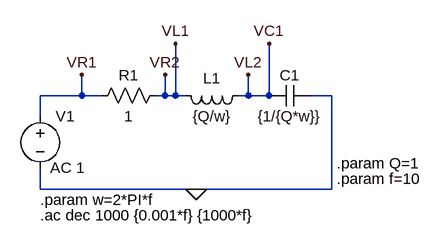
[diagram p0: schematic Circuito RLC serie.asc]
Circuito RLC serie.asc, the LTspice schematic file:
Version 4
SHEET 1 880 680
WIRE 96 96 96 64
WIRE 96 96 32 96
WIRE 128 96 96 96
WIRE 224 96 224 64
WIRE 224 96 208 96
WIRE 240 96 240 16
WIRE 240 96 224 96
WIRE 256 96 240 96
WIRE 352 96 352 64
WIRE 352 96 336 96
WIRE 384 96 384 16
WIRE 384 96 352 96
WIRE 480 96 448 96
WIRE 32 128 32 96
WIRE 32 240 32 208
WIRE 272 240 32 240
WIRE 480 240 480 96
WIRE 480 240 272 240
FLAG 272 240 0
FLAG 96 64 VR1
FLAG 240 16 VL1
FLAG 384 16 VC1
FLAG 224 64 VR2
FLAG 352 64 VL2
SYMBOL voltage 32 112 R0
WINDOW 3 9 102 Left 2
WINDOW 123 15 95 Left 2
WINDOW 39 0 0 Left 0
SYMATTR Value ""
SYMATTR Value2 AC 1
SYMATTR InstName V1
SYMBOL res 224 80 R90
WINDOW 0 0 56 VBottom 2
WINDOW 3 32 56 VTop 2
SYMATTR InstName R1
SYMATTR Value 1
SYMBOL ind 352 80 R90
WINDOW 0 5 56 VBottom 2
WINDOW 3 32 56 VTop 2
SYMATTR InstName L1
SYMATTR Value {Q/w}
SYMBOL cap 448 80 R90
WINDOW 0 0 32 VBottom 2
WINDOW 3 32 32 VTop 2
SYMATTR InstName C1
SYMATTR Value {1/{Q*w}}
TEXT 32 256 Left 2 !.param w=2*PI*f
TEXT 488 200 Left 2 !.param Q=1
TEXT 32 280 Left 2 !.ac dec 1000 {0.001*f} {1000*f}
TEXT 488 224 Left 2 !.param f=10

The netlist it stands for:
* Circuito RLC serie.asc
V1 VR1 0 AC 1
R1 VR2 VR1 1
L1 VL2 VR2 {Q/w}
C1 0 VL2 {1/{Q*w}}
.param w=2*PI*f
.param Q=1
.ac dec 1000 {0.001*f} {1000*f}
.param f=10
.backanno
.end